# EAGLE schematic os20.newenc (EAGLE 6.3)
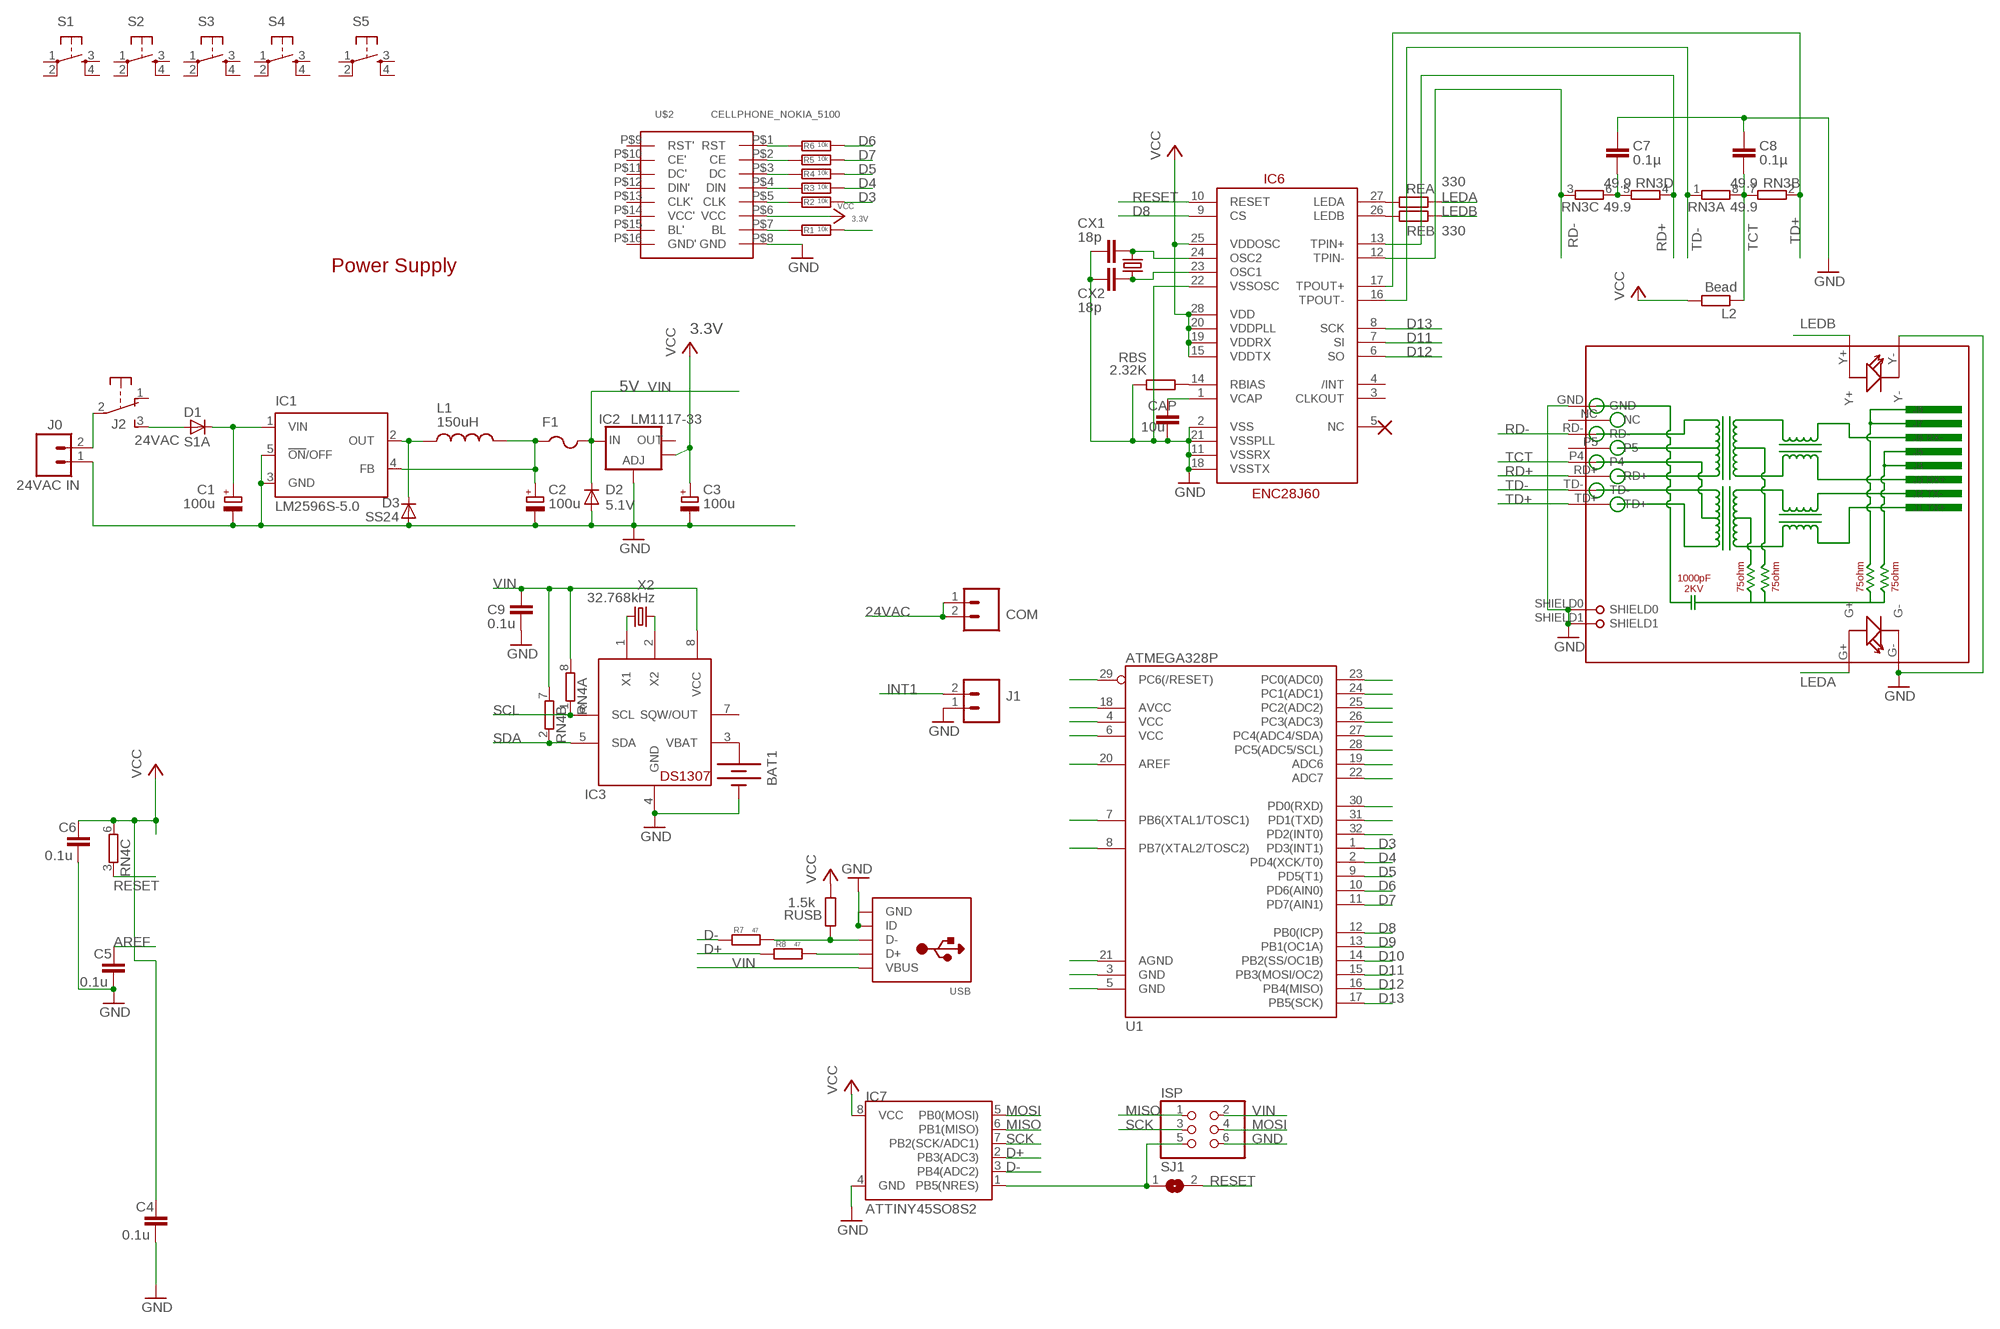
[diagram p0: schematic, sheet 1]

## Parts
BAT1  BATTERYBATTERY_12MM_SMT  [BATTCON_12MM_SMT]
C1  100u  CPOL-EUE3.5-8  [E3,5-8]
C2  100u  CPOL-EUD  [PANASONIC_D]
C3  100u  CPOL-EUD  [PANASONIC_D]
C4  0.1u  C-EUC0805  [C0805]
C5  0.1u  C-EUC0805  [C0805]
C6  0.1u  C-EUC0805  [C0805]
C7  0.1µ  C-EUC0805  [C0805]
C8  0.1µ  C-EUC0805  [C0805]
C9  0.1u  C-EUC0805  [C0805]
CAP  10u  C-EUC0805  [C0805]
COM  M025MM  [SCREWTERMINAL-5MM-2]
CX1  18p  C-EUC0805  [C0805]
CX2  18p  C-EUC0805  [C0805]
D1  S1A  DIODE-DO-214AC  [DO-214AC]
D2  5.1V  DIODE-MINIMELF  [MINIMELF]
D3  SS24  DIODE-DO-214AC  [DO-214AC]
F1  PTCFUSE-1812  [1812]
IC1  LM2596S-5.0  LM2596S  [TO263-5]
IC2  LM1117-33  V_REG_LM1117SOT223  [SOT223]
IC3  DS1307  DS1307SOIC  [SO08]
IC6  ENC28J60  [SSOP28DB]
IC7  ATTINY45SO8S2  [SO8S2]
ISP  PINHD-2X3  [2X03]
J0  24VAC IN  M025MM  [SCREWTERMINAL-5MM-2]
J1  M025MM  [SCREWTERMINAL-5MM-2]
J2  EG1206  [EG1206]
L1  150uH  INDUCTORPWR  [CDRH125]
L2  Bead  R-EU_R0805  [R0805]
R1  10k  R-EU_R0805  [R0805]
R2  10k  R-EU_R0805  [R0805]
R3  10k  R-EU_R0805  [R0805]
R4  10k  R-EU_R0805  [R0805]
R5  10k  R-EU_R0805  [R0805]
R6  10k  R-EU_R0805  [R0805]
R7  47  R-EU_R0805  [R0805]
R8  47  R-EU_R0805  [R0805]
RBS  2.32K  R-EU_R0805  [R0805]
REA  330  R-EU_R0805  [R0805]
REB  330  R-EU_R0805  [R0805]
RJ45  HR911105A  [HR911105A]
RN3  49.9  4R-NEXB38V  [EXB38V]
RN4  4R-NEXB38V  [EXB38V]
RUSB  1.5k  R-EU_R0805  [R0805]
S1  TAC_SWITCHPTH  [TACTILE-PTH]
S2  TAC_SWITCHPTH  [TACTILE-PTH]
S3  TAC_SWITCHPTH  [TACTILE-PTH]
S4  TAC_SWITCHPTH  [TACTILE-PTH]
S5  TAC_SWITCHPTH  [TACTILE-PTH]
SJ1  SJ  [SJ]
U1  ATMEGA328P  ATMEGA328_SMT  [TQFP32-08]
U$2  CELLPHONE_NOKIA_5100  [CELLPHONE_NOKIA_5100_SPARKFUN]
USB  USBMOLEX  [USB-MINIB-THM-MOLEX]
X1  25MHz  CRYSTALHC49US  [HC49US]
X2  32.768kHz  CRYSTALTC26H  [TC26H]

## Nets
24VAC [power]: COM.1 COM.2 D1.A J2.3(S)
AREF: C5.1
D3: R2.2 U1.1(PD3(INT1))
D4: R3.2 U1.2(PD4(XCK/T0))
D5: R4.2 U1.9(PD5(T1))
D6: R6.2 U1.10(PD6(AIN0))
D7: R5.2 U1.11(PD7(AIN1))
D8: IC6.9(CS) U1.12(PB0(ICP))
D9: U1.13(PB1(OC1A))
D10: U1.14(PB2(SS/OC1B))
D11: IC6.7(SI) U1.15(PB3(MOSI/OC2))
D12: IC6.6(SO) U1.16(PB4(MISO))
D13: IC6.8(SCK) U1.17(PB5(SCK))
D+: IC7.2(PB3(ADC3)) R8.1
D-: IC7.3(PB4(ADC2)) R7.1
GND: BAT1.P$1(-) C1.- C2.- C3.- C4.2 C5.2 C6.2 C7.1 C8.1 C9.2 CAP.2 CX1.2 CX2.2 D2.A D3.A IC1.3(GND) IC1.5(!ON!/OFF) IC2.1(ADJ) IC3.4(GND) IC6.2(VSS) IC6.11(VSSRX) IC6.18(VSSTX) IC6.21(VSSPLL) IC6.22(VSSOSC) IC7.4(GND) ISP.6 J0.1 J1.1 RBS.1 RJ45.G- RJ45.GND RJ45.SHIELD0 RJ45.SHIELD1 RJ45.Y- U$2.P$8(GND) USB.GND USB.ID
INT1: J1.2
LEDA: REA.2 RJ45.G+
LEDB: REB.2 RJ45.Y+
MISO: IC7.6(PB1(MISO)) ISP.1
MOSI: IC7.5(PB0(MOSI)) ISP.4
N$1 [power]: C1.+ D1.C IC1.1(VIN)
N$2 [power]: C2.+ F1.1 IC1.4(FB) L1.2
N$3: U1.23(PC0(ADC0))
N$4: U1.24(PC1(ADC1))
N$5: U1.25(PC2(ADC2))
N$6 [power]: J0.2 J2.2(P)
N$7: U1.26(PC3(ADC3))
N$8: IC3.1(X1) X2.2
N$9 [power]: D3.C IC1.2(OUT) L1.1
N$10: U1.27(PC4(ADC4/SDA))
N$11: U1.28(PC5(ADC5/SCL))
N$12: U1.19(ADC6)
N$13: U1.22(ADC7)
N$14: U1.30(PD0(RXD))
N$15: U1.31(PD1(TXD))
N$16: U1.32(PD2(INT0))
N$22: R2.1 U$2.P$5(CLK)
N$23: R5.1 U$2.P$2(CE)
N$24: R4.1 U$2.P$3(DC)
N$25: R3.1 U$2.P$4(DIN)
N$26: R1.1 U$2.P$7(BL)
N$28: U1.5(GND)
N$29: U1.3(GND)
N$30: IC3.2(X2) X2.1
N$31: U1.21(AGND)
N$32: U1.8(PB7(XTAL2/TOSC2))
N$33: U1.7(PB6(XTAL1/TOSC1))
N$34: IC6.27(LEDA) REA.1
N$35: U1.20(AREF)
N$36: BAT1.P$2(+) IC3.3(VBAT)
N$37: IC6.26(LEDB) REB.1
N$38: R8.2 USB.D+
N$39: CAP.1 IC6.1(VCAP)
N$40: U1.6(VCC)
N$41: CX1.1 IC6.24(OSC2) X1.2
N$42: CX2.1 IC6.23(OSC1) X1.1
N$43: U1.4(VCC)
N$44: U1.18(AVCC)
N$45: R7.2 RUSB.1 USB.D-
N$46: U1.29(PC6(/RESET))
N$51: R1.2
N$52: IC7.1(PB5(NRES)) ISP.5 SJ1.1
N$54: C7.2 RN3.5 RN3.6
N$59: IC6.14(RBIAS) RBS.2
RD+: IC6.13(TPIN+) RJ45.RD+ RN3.4
RD-: IC6.12(TPIN-) RJ45.RD- RN3.3
RESET: IC6.10(RESET) RN4.3 SJ1.2
SCK: IC7.7(PB2(SCK/ADC1)) ISP.3
SCL: IC3.6(SCL) RN4.1
SDA: IC3.5(SDA) RN4.2
TCT: C8.2 L2.1 RJ45.P4 RN3.7 RN3.8
TD+: IC6.17(TPOUT+) RJ45.TD+ RN3.2
TD-: IC6.16(TPOUT-) RJ45.TD- RN3.1
V$: R6.1 U$2.P$1(RST)
VCC: C3.+ C4.1 C6.1 IC2.4(OUT) IC6.15(VDDTX) IC6.19(VDDRX) IC6.20(VDDPLL) IC6.25(VDDOSC) IC6.28(VDD) IC7.8(VCC) L2.2 RN4.6 RUSB.2 U$2.P$6(VCC)
VIN [power]: C9.1 D2.C F1.2 IC2.3(IN) IC3.8(VCC) ISP.2 RN4.7 RN4.8 USB.VBUS
Unconnected: IC2.2(OUT) IC3.7(SQW/OUT) IC6.3(CLKOUT) IC6.4(/INT) IC6.5(NC) J2.1(O) RJ45.NC RJ45.P5 RN4.4 RN4.5 S1.1 S1.2 S1.3 S1.4 S2.1 S2.2 S2.3 S2.4 S3.1 S3.2 S3.3 S3.4 S4.1 S4.2 S4.3 S4.4 S5.1 S5.2 S5.3 S5.4 U$2.P$9(RST') U$2.P$10(CE') U$2.P$11(DC') U$2.P$12(DIN') U$2.P$13(CLK') U$2.P$14(VCC') U$2.P$15(BL') U$2.P$16(GND')

## Notes on the sheet
- 3.3V
- Power Supply
- 3.3V
- 5V

## Library data of the parts
BAT1 = SparkFunNew:BATTERY: Battery Holders Various common sizes : AA, AAA, 20mm coin cell and 12mm coin cell.
C1-C3 = resistor:CPOL-EU: POLARIZED CAPACITOR, European symbol
C4-C6 C9 = rcl:C-EU: CAPACITOR, European symbol
C7 C8 CAP CX1 CX2 = resistor:C-EU: CAPACITOR, European symbol
COM J0 J1 = SparkFun:M02: Header 2 Standard 2-pin 0.1" header. Use with straight break away headers (SKU : PRT-00116), right angle break away headers (PRT-00553), swiss pins (PRT-00743), machine pins (PRT-00117), and female headers (PRT-00115). Molex polarized connector foot print use with SKU : PRT-08233 with associated crimp pins and housings.
D1-D3 = diode:DIODE-: DIODE
F1 = adafruit:PTCFUSE: PTC fuses, resettable thermistors
IC1 = national-semiconductor:LM2596: SIMPLE SWITCHER® Power Converter 150 kHz 3A Step-Down Voltage Regulator Source: http://www.national.com/ds/LM/LM2596.pdf; MF: NATIONAL SEMICONDUCTOR; MPN: LM2596S-ADJ/NOPB; OC_FARNELL: 9494367; OC_NEWARK: 41K3842
IC2 = SparkFun:V_REG_LM1117: Voltage Regulator LM1117 Standard adjustable voltage regulator but in SMD form. Spark Fun Electronics SKU : COM-00595
IC3 = adafruit:DS1307: DS1307 Real time clock (RTC) with battery backup ability. Talk to it via i2c
IC6 = SparkFun-DigitalIC:ENC28J60: Microchip SPI 10Base ethernet IC
IC7 = SparkFun:ATTINY45: Atmel ATTiny45
ISP = pinhead:PINHD-2X3: PIN HEADER
J2 = adafruit:EG1206
L1 = SparkFunNew:INDUCTOR: Inductors Basic Inductor/Choke - 0603 and 1206. Footprints are not proven and vary greatly between part numbers.
L2 R1-R8 RBS REA REB RUSB = rcl:R-EU_: RESISTOR, European symbol
RJ45 = CONNECTER:HR911105A
RN3 RN4 = resistor-dil:4R-N: Array Chip Resistor Source: RS Component / Phycomp; OC_FARNELL: unknown; OC_NEWARK: unknown
S1-S5 = SparkFun-Electromechanical:TAC_SWITCH: Momentary Switch Button commonly used for reset or general input. Spark Fun Electronics SKU : COM-00097 SMT- SWCH-08247
SJ1 = jumper:SJ: SMD solder JUMPER
U1 = SparkFun-DigitalIC:ATMEGA328_SMT: 32-Pin Atmega328 part Commonly used on Arduino compatible boards Available in QFP and QFN packages TQFP is IC-09069 QFN is non-stock; PROD_ID: IC-09069
U$2 = DIY-Cellphone:CELLPHONE_NOKIA_5100
USB = adafruit:USB: USB Connectors USBMINIB - Surface Mount Female Mini-B USB Connector 4UConnector: 06564 By microbuilder.eu Thru-hole RA Female Mini-B USB Connector 4UConnector: 18732 By ladyada.net
X1 = SparkFun:CRYSTAL: Crystals Various standard crystals. Proven footprints. Spark Fun Electronics SKU : COM-00534
X2 = crystal:CRYSTAL: CRYSTAL; OC_FARNELL: unknown; OC_NEWARK: unknown

## Net classes
0 default: width 0.305 mm, clearance 0.203 mm
1 power: width 0.61 mm, clearance 0.203 mm